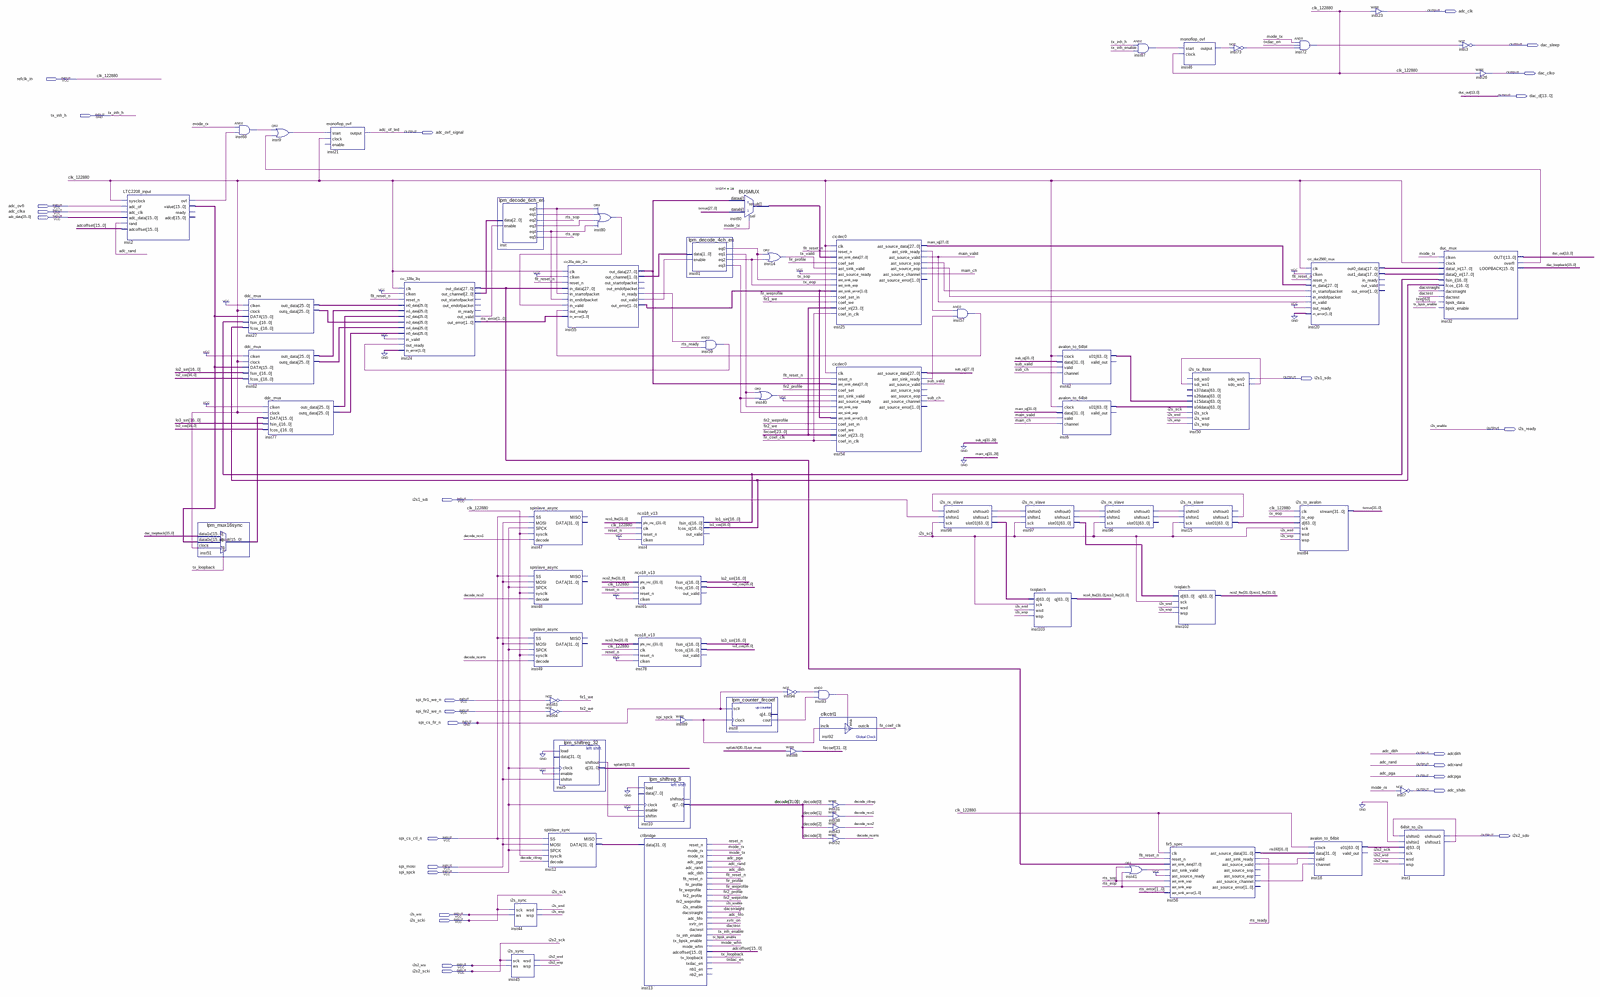
[diagram p0: schematic sheet, whole]
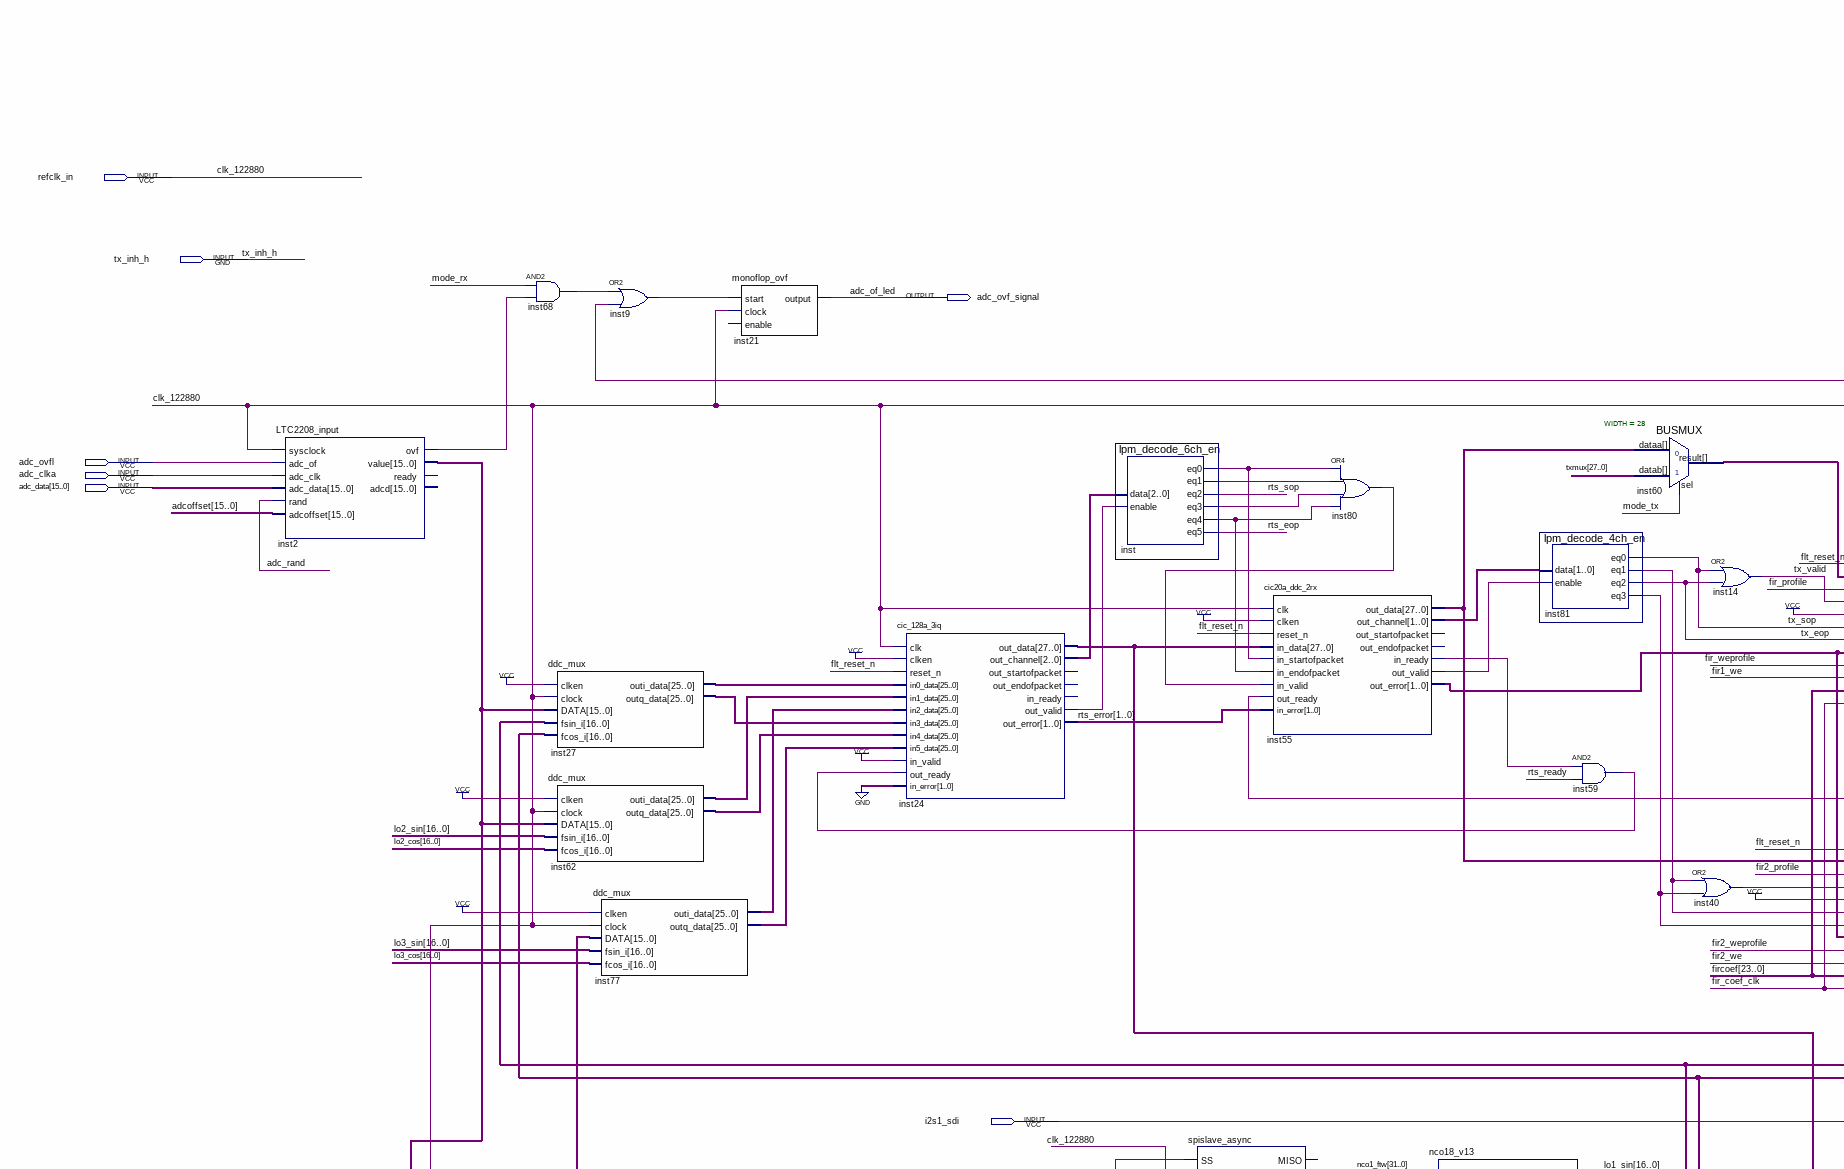
[diagram p1: schematic sheet, upper left part]
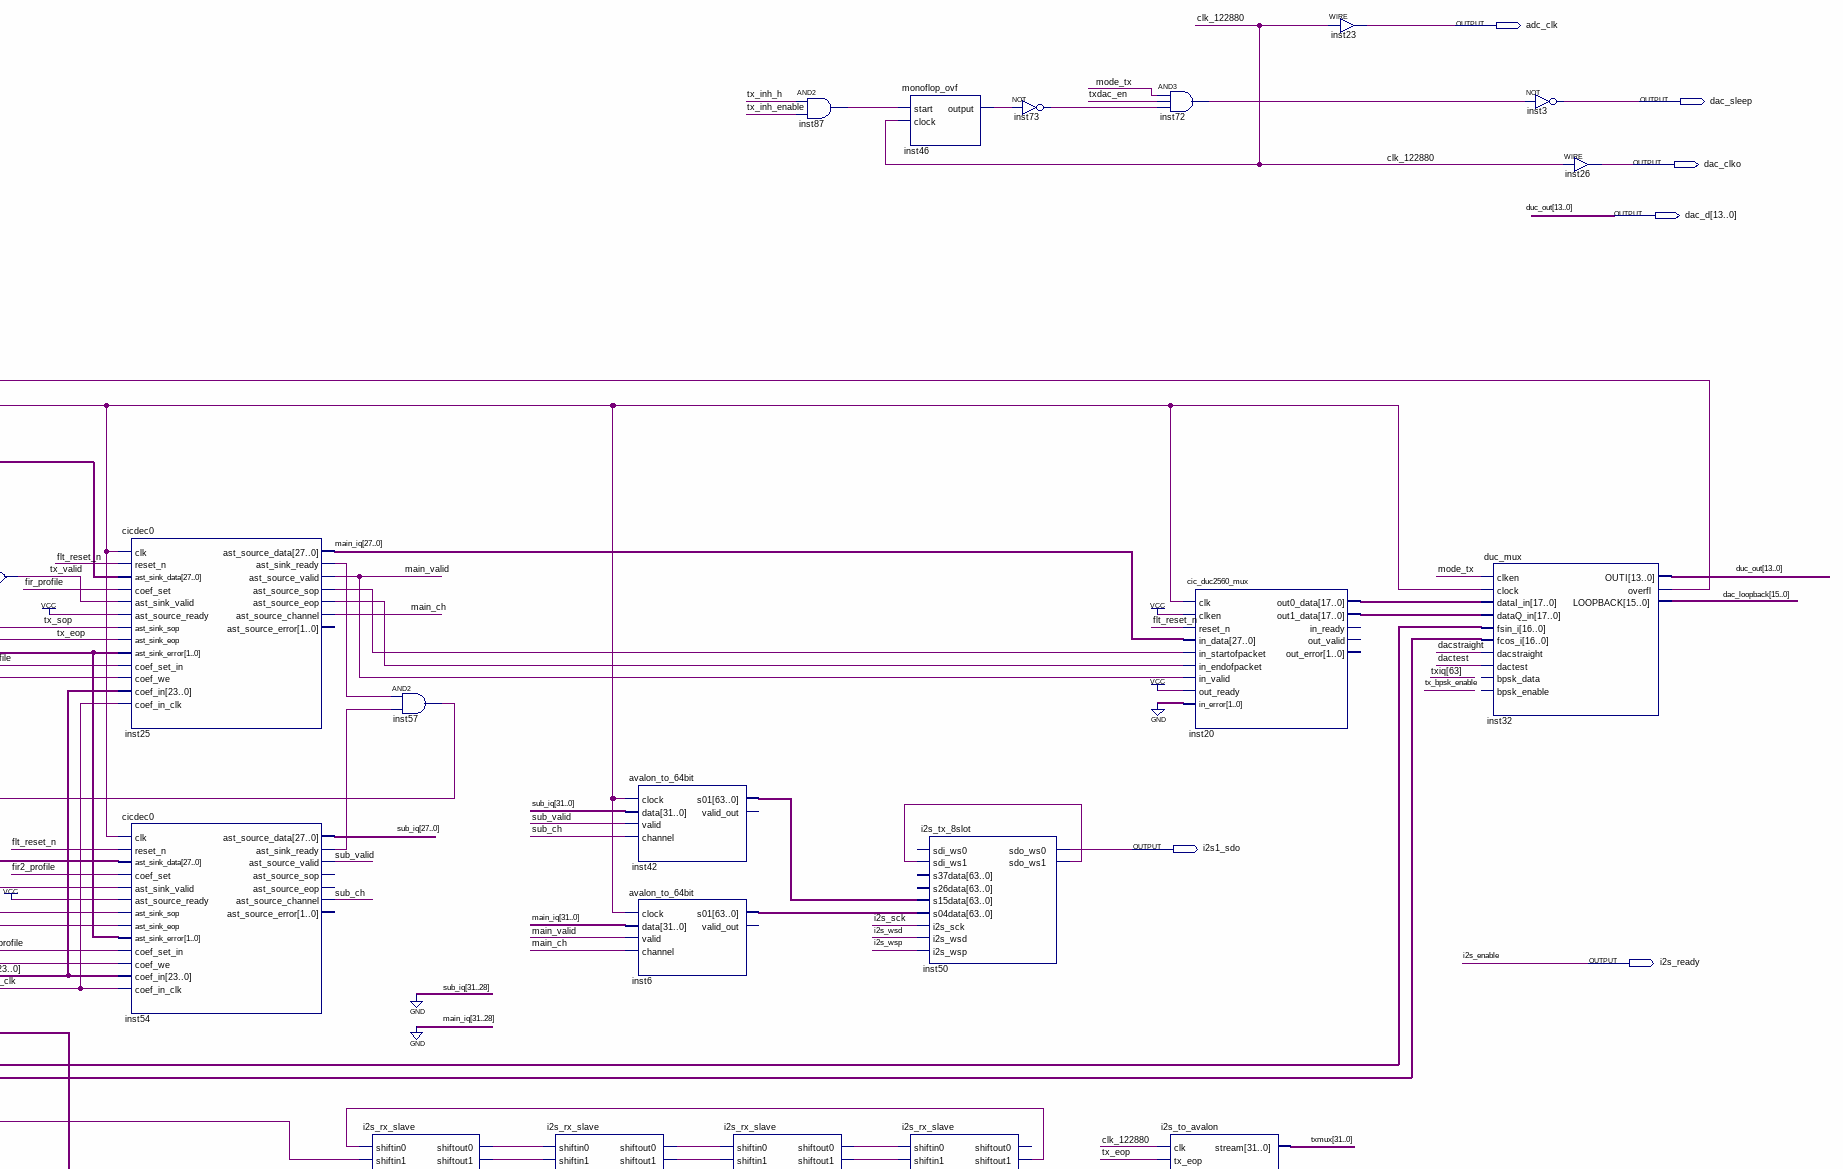
[diagram p2: schematic sheet, upper right part]
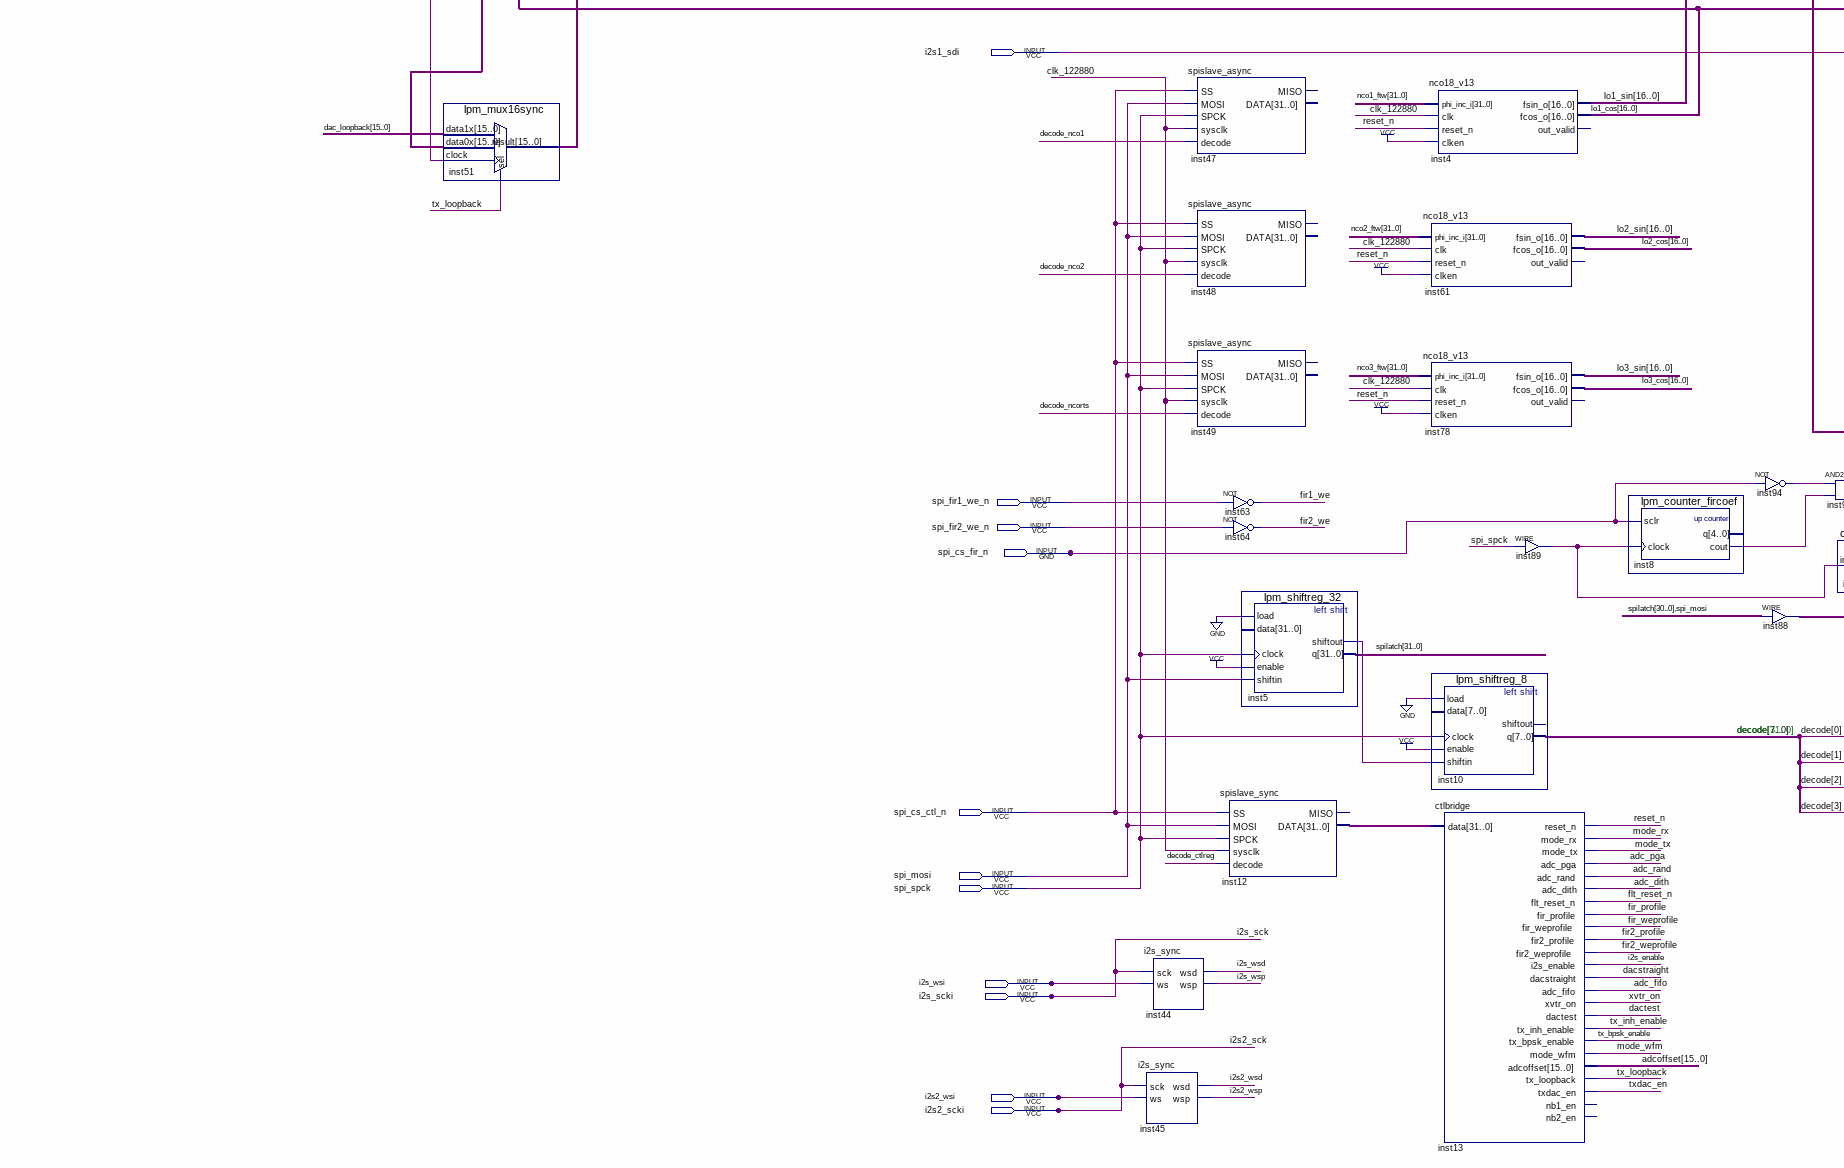
[diagram p3: schematic sheet, lower left part]
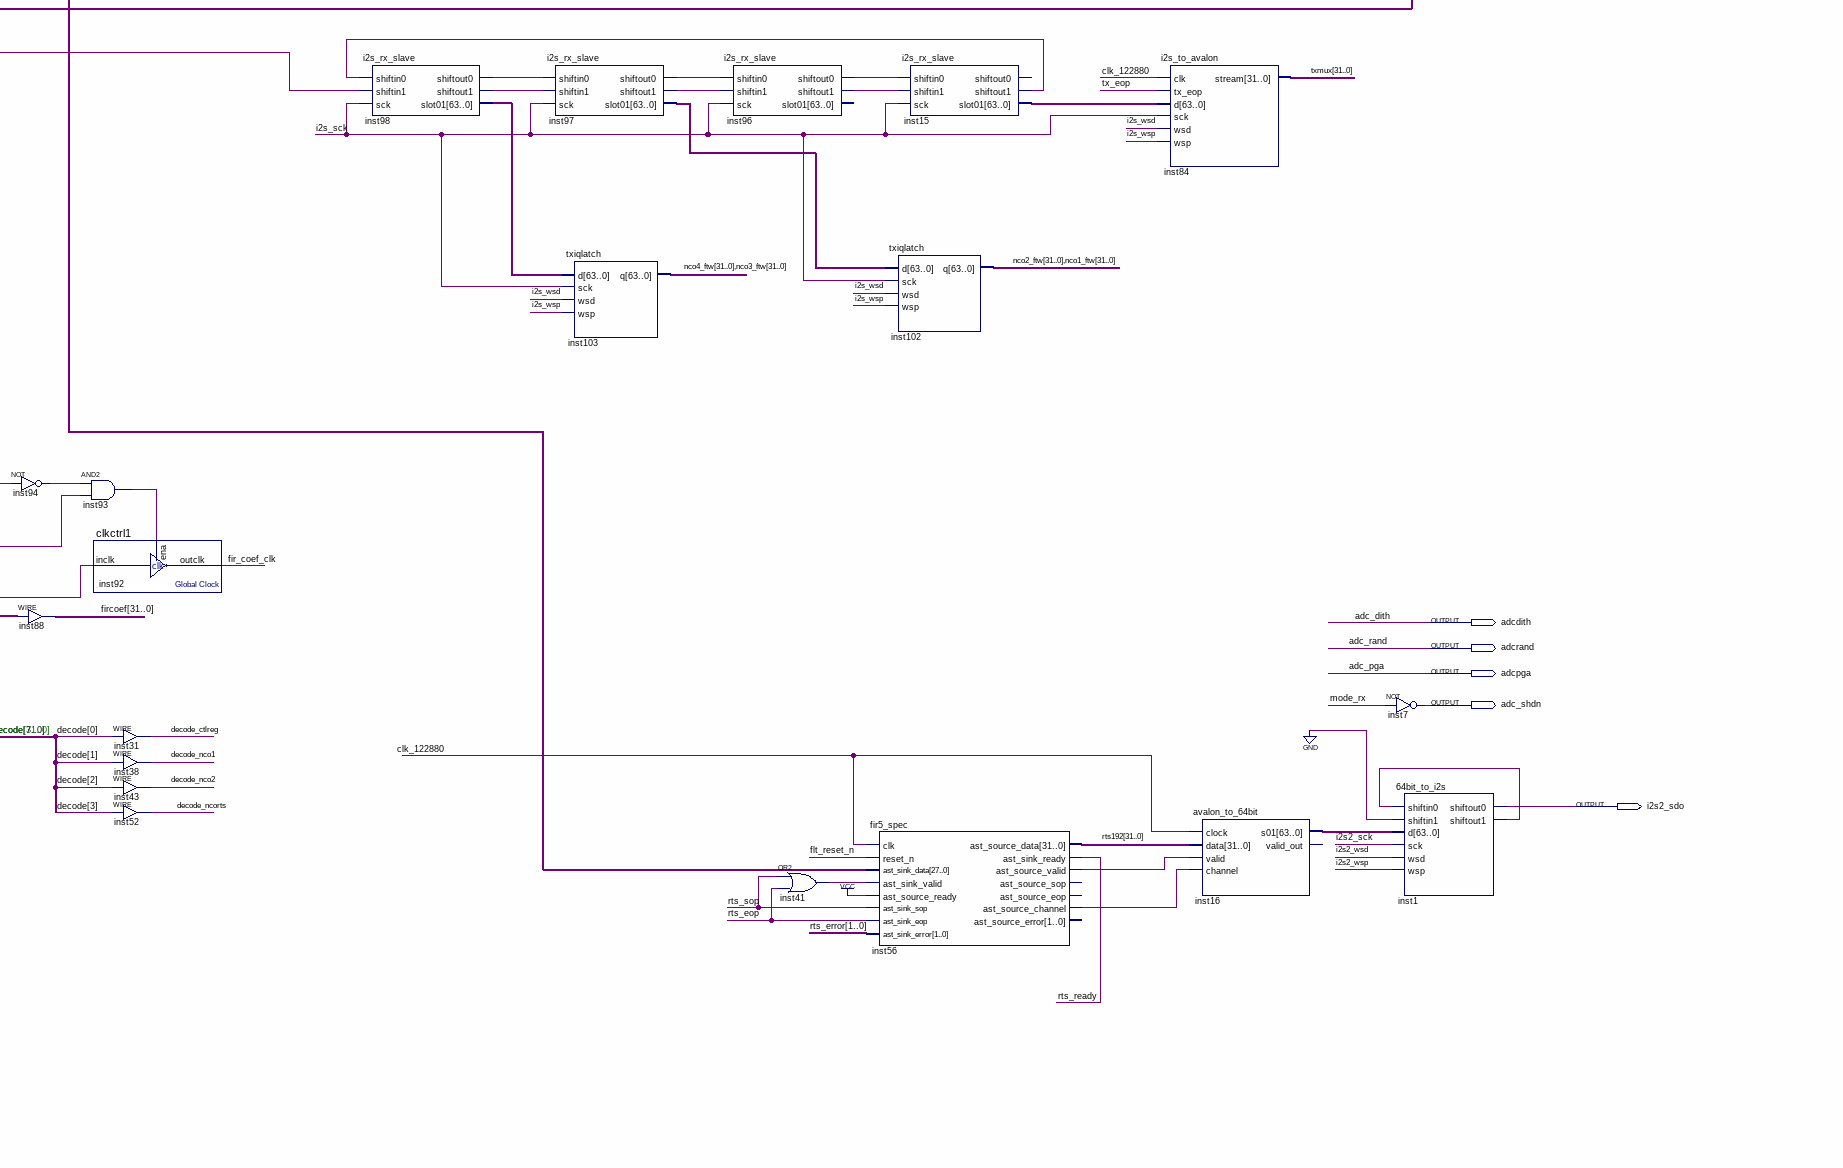
[diagram p4: schematic sheet, lower right part]
// Quartus schematic t1_2ch_rts192.bdf as structural Verilog: 68 symbols, 28 pins
module t1_2ch_rts192 (
  input  refclk_in,
  input  tx_inh_h,
  input  adc_ovfl,
  input  adc_clka,
  input  [15:0] adc_data,
  input  i2s1_sdi,
  input  spi_fir1_we_n,
  input  spi_fir2_we_n,
  input  spi_cs_fir_n,
  input  spi_cs_ctl_n,
  input  spi_mosi,
  input  spi_spck,
  input  i2s_wsi,
  input  i2s_scki,
  input  i2s2_wsi,
  input  i2s2_scki,
  output adc_clk,
  output dac_sleep,
  output dac_clko,
  output [13:0] dac_d,
  output adc_ovf_signal,
  output i2s1_sdo,
  output i2s_ready,
  output adcdith,
  output adcrand,
  output adcpga,
  output adc_shdn,
  output i2s2_sdo
);

  wire adc_fifo, dacstraight, dactest, decode_ctlreg, decode_nco1, decode_nco2, decode_ncorts, fir1_we,
       fir2_profile, fir2_we, fir2_weprofile, fir_coef_clk, fir_profile, fir_weprofile, flt_reset_n,
       i2s2_wsd, i2s2_wsp, i2s_wsd, i2s_wsp, inst1_shiftout1, inst2_ovf, inst5_shiftout, inst8_cout,
       inst9_out, inst15_shiftout1, inst24_out_valid, inst25_ast_sink_ready, inst25_ast_source_eop,
       inst25_ast_source_sop, inst32_overfl, inst40_out, inst41_out, inst46_output, inst50_sdo_ws1,
       inst54_ast_sink_ready, inst55_in_ready, inst55_out_valid, inst56_ast_source_channel,
       inst56_ast_source_valid, inst57_out, inst59_out, inst68_out, inst72_out, inst73_out, inst80_out,
       inst81_eq1, inst81_eq3, inst87_out, inst89_out, inst93_out, inst94_out, inst96_shiftout0,
       inst96_shiftout1, inst97_shiftout0, inst97_shiftout1, inst98_shiftout0, inst98_shiftout1, inst_eq0,
       inst_eq1, inst_eq3, inst_eq4, main_ch, main_valid, mode_rx, mode_tx, mode_wfm, reset_n, rts_eop,
       rts_ready, rts_sop, sub_ch, sub_valid, tx_bpsk_enable, tx_eop, tx_inh_enable, tx_loopback, tx_sop,
       tx_valid, txdac_en, xvtr_on;
  wire [1:0] inst55_out_channel, inst55_out_error, rts_error;
  wire [2:0] inst24_out_channel;
  wire [7:0] decode;
  wire [15:0] adcoffset, dac_loopback, inst2_value, inst51_result;
  wire [16:0] lo1_cos, lo1_sin, lo2_cos, lo2_sin, lo3_cos, lo3_sin;
  wire [17:0] inst20_out0_data, inst20_out1_data;
  wire [25:0] inst27_outi_data, inst27_outq_data, inst62_outi_data, inst62_outq_data, inst77_outi_data,
       inst77_outq_data;
  wire [27:0] inst24_out_data, inst55_out_data, inst60_result, main_iq, sub_iq;
  wire [31:0] fircoef, inst12_data, nco1_ftw, nco2_ftw, nco3_ftw, nco4_ftw, rts192, spilatch, txmux;
  wire [63:0] inst6_s01, inst15_slot01, inst16_s01, inst42_s01, inst97_slot01, inst98_slot01;

  LTC2208_input inst2 (
    .sysclock(refclk_in), .adc_of(adc_ovfl), .adc_clk(adc_clka), .adc_data(adc_data), .\rand (adcrand),
    .adcoffset(adcoffset), .ovf(inst2_ovf), .value(inst2_value));  // open: ready, adcd
  lpm_mux16sync inst51 (
    .data1x(dac_loopback), .data0x(inst2_value), .clock(refclk_in), .sel(tx_loopback), .result(inst51_result));
  and inst68 (inst68_out, mode_rx, inst2_ovf);
  ddc_mux inst27 (
    .clken(1'b1), .clock(refclk_in), .DATA(inst2_value), .fsin_i(lo1_sin), .fcos_i(lo1_cos),
    .outi_data(inst27_outi_data), .outq_data(inst27_outq_data));
  ddc_mux inst62 (
    .clken(1'b1), .clock(refclk_in), .DATA(inst2_value), .fsin_i(lo2_sin), .fcos_i(lo2_cos),
    .outi_data(inst62_outi_data), .outq_data(inst62_outq_data));
  or inst9 (inst9_out, inst68_out, inst32_overfl);
  ddc_mux inst77 (
    .clken(1'b1), .clock(refclk_in), .DATA(inst51_result), .fsin_i(lo3_sin), .fcos_i(lo3_cos),
    .outi_data(inst77_outi_data), .outq_data(inst77_outq_data));
  monoflop_ovf inst21 (.start(inst9_out), .clock(refclk_in), .\output (adc_ovf_signal));  // open: enable
  cic_128a_3iq inst24 (
    .clk(refclk_in), .clken(1'b1), .reset_n(flt_reset_n), .in0_data(inst27_outi_data),
    .in1_data(inst62_outi_data), .in2_data(inst77_outi_data), .in3_data(inst27_outq_data),
    .in4_data(inst62_outq_data), .in5_data(inst77_outq_data), .in_valid(1'b1), .out_ready(inst59_out),
    .in_error(2'b00), .out_data(inst24_out_data), .out_channel(inst24_out_channel),
    .out_valid(inst24_out_valid), .out_error(rts_error));  // open: out_startofpacket, out_endofpacket, in_ready
  lpm_decode_6ch_en inst (
    .data(inst24_out_channel), .enable(inst24_out_valid), .eq0(inst_eq0), .eq1(inst_eq1), .eq2(rts_sop),
    .eq3(inst_eq3), .eq4(inst_eq4), .eq5(rts_eop));
  i2s_sync inst44 (.sck(i2s_scki), .ws(i2s_wsi), .wsd(i2s_wsd), .wsp(i2s_wsp));
  i2s_sync inst45 (.sck(i2s2_scki), .ws(i2s2_wsi), .wsd(i2s2_wsd), .wsp(i2s2_wsp));
  spislave_async inst47 (
    .SS(spi_cs_ctl_n), .MOSI(spi_mosi), .SPCK(spi_spck), .sysclk(refclk_in), .decode(decode_nco1));  // open: MISO, DATA
  spislave_async inst48 (
    .SS(spi_cs_ctl_n), .MOSI(spi_mosi), .SPCK(spi_spck), .sysclk(refclk_in), .decode(decode_nco2));  // open: MISO, DATA
  spislave_async inst49 (
    .SS(spi_cs_ctl_n), .MOSI(spi_mosi), .SPCK(spi_spck), .sysclk(refclk_in), .decode(decode_ncorts));  // open: MISO, DATA
  not inst63 (fir1_we, spi_fir1_we_n);
  not inst64 (fir2_we, spi_fir2_we_n);
  spislave_sync inst12 (
    .SS(spi_cs_ctl_n), .MOSI(spi_mosi), .SPCK(spi_spck), .sysclk(refclk_in), .decode(decode_ctlreg),
    .DATA(inst12_data));  // open: MISO
  cic20a_ddc_2rx inst55 (
    .clk(refclk_in), .clken(1'b1), .reset_n(flt_reset_n), .in_data(inst24_out_data),
    .in_startofpacket(inst_eq0), .in_endofpacket(inst_eq4), .in_valid(inst80_out), .out_ready(inst57_out),
    .in_error(rts_error), .out_data(inst55_out_data), .out_channel(inst55_out_channel),
    .in_ready(inst55_in_ready), .out_valid(inst55_out_valid), .out_error(inst55_out_error));  // open: out_startofpacket, out_endofpacket
  lpm_shiftreg_32 inst5 (
    .load(1'b0), .clock(spi_spck), .enable(1'b1), .shiftin(spi_mosi), .shiftout(inst5_shiftout), .q(spilatch));  // open: data
  or inst80 (inst80_out, inst_eq0, inst_eq1, inst_eq3, inst_eq4);
  nco18_v13 inst4 (
    .phi_inc_i(nco1_ftw), .clk(refclk_in), .reset_n(reset_n), .clken(1'b1), .fsin_o(lo1_sin), .fcos_o(lo1_cos));  // open: out_valid
  nco18_v13 inst61 (
    .phi_inc_i(nco2_ftw), .clk(refclk_in), .reset_n(reset_n), .clken(1'b1), .fsin_o(lo2_sin), .fcos_o(lo2_cos));  // open: out_valid
  nco18_v13 inst78 (
    .phi_inc_i(nco3_ftw), .clk(refclk_in), .reset_n(reset_n), .clken(1'b1), .fsin_o(lo3_sin), .fcos_o(lo3_cos));  // open: out_valid
  lpm_shiftreg_8 inst10 (
    .load(1'b0), .clock(spi_spck), .enable(1'b1), .shiftin(inst5_shiftout), .q(decode));  // open: data, shiftout
  ctlbridge inst13 (
    .data(inst12_data), .reset_n(reset_n), .mode_rx(mode_rx), .mode_tx(mode_tx), .adc_pga(adcpga),
    .adc_rand(adcrand), .adc_dith(adcdith), .flt_reset_n(flt_reset_n), .fir_profile(fir_profile),
    .fir_weprofile(fir_weprofile), .fir2_profile(fir2_profile), .fir2_weprofile(fir2_weprofile),
    .i2s_enable(i2s_ready), .dacstraight(dacstraight), .adc_fifo(adc_fifo), .xvtr_on(xvtr_on),
    .dactest(dactest), .tx_inh_enable(tx_inh_enable), .tx_bpsk_enable(tx_bpsk_enable), .mode_wfm(mode_wfm),
    .adcoffset(adcoffset), .tx_loopback(tx_loopback), .txdac_en(txdac_en));  // open: nb1_en, nb2_en
  assign inst89_out = spi_spck;  // WIRE inst89
  lpm_decode_4ch_en inst81 (
    .data(inst55_out_channel), .enable(inst55_out_valid), .eq0(tx_sop), .eq1(inst81_eq1), .eq2(tx_eop),
    .eq3(inst81_eq3));
  and inst59 (inst59_out, inst55_in_ready, rts_ready);
  BUSMUX #(.WIDTH(28)) inst60 (.datab(txmux[27:0]), .sel(mode_tx), .dataa(inst55_out_data), .result(inst60_result));
  lpm_counter_fircoef inst8 (.sclr(spi_cs_fir_n), .clock(inst89_out), .cout(inst8_cout));  // open: q
  or inst14 (tx_valid, tx_sop, tx_eop);
  or inst40 (inst40_out, inst81_eq1, inst81_eq3);
  not inst94 (inst94_out, spi_cs_fir_n);
  assign fircoef = {spilatch[30:0], spi_mosi};  // WIRE inst88
  and inst93 (inst93_out, inst94_out, inst8_cout);
  clkctrl1 inst92 (.inclk(inst89_out), .ena(inst93_out), .outclk(fir_coef_clk));
  cicdec0 inst25 (
    .clk(refclk_in), .reset_n(flt_reset_n), .ast_sink_data(inst60_result), .coef_set(fir_profile),
    .ast_sink_valid(tx_valid), .ast_source_ready(1'b1), .ast_sink_sop(tx_sop), .ast_sink_eop(tx_eop),
    .ast_sink_error(inst55_out_error), .coef_set_in(fir_weprofile), .coef_we(fir1_we),
    .coef_in(fircoef[23:0]), .coef_in_clk(fir_coef_clk), .ast_source_data(main_iq),
    .ast_sink_ready(inst25_ast_sink_ready), .ast_source_valid(main_valid),
    .ast_source_sop(inst25_ast_source_sop), .ast_source_eop(inst25_ast_source_eop),
    .ast_source_channel(main_ch));  // open: ast_source_error
  cicdec0 inst54 (
    .clk(refclk_in), .reset_n(flt_reset_n), .ast_sink_data(inst55_out_data), .coef_set(fir2_profile),
    .ast_sink_valid(inst40_out), .ast_source_ready(1'b1), .ast_sink_sop(inst81_eq1),
    .ast_sink_eop(inst81_eq3), .ast_sink_error(inst55_out_error), .coef_set_in(fir2_weprofile),
    .coef_we(fir2_we), .coef_in(fircoef[23:0]), .coef_in_clk(fir_coef_clk), .ast_source_data(sub_iq),
    .ast_sink_ready(inst54_ast_sink_ready), .ast_source_valid(sub_valid), .ast_source_channel(sub_ch));  // open: ast_source_sop, ast_source_eop, ast_source_error
  assign decode_ctlreg = decode[0];  // WIRE inst31
  assign decode_nco1 = decode[1];  // WIRE inst38
  assign decode_nco2 = decode[2];  // WIRE inst43
  assign decode_ncorts = decode[3];  // WIRE inst52
  and inst57 (inst57_out, inst25_ast_sink_ready, inst54_ast_sink_ready);
  i2s_rx_slave inst98 (
    .shiftin0(inst15_shiftout1), .shiftin1(i2s1_sdi), .sck(i2s_scki), .shiftout0(inst98_shiftout0),
    .shiftout1(inst98_shiftout1), .slot01(inst98_slot01));
  i2s_rx_slave inst97 (
    .shiftin0(inst98_shiftout0), .shiftin1(inst98_shiftout1), .sck(i2s_scki), .shiftout0(inst97_shiftout0),
    .shiftout1(inst97_shiftout1), .slot01(inst97_slot01));
  txiqlatch inst103 (.d(inst98_slot01), .sck(i2s_scki), .wsd(i2s_wsd), .wsp(i2s_wsp), .q({nco4_ftw, nco3_ftw}));
  avalon_to_64bit inst42 (
    .clock(refclk_in), .data({4'b0000, sub_iq}), .valid(sub_valid), .channel(sub_ch), .s01(inst42_s01));  // open: valid_out
  avalon_to_64bit inst6 (
    .clock(refclk_in), .data({4'b0000, main_iq}), .valid(main_valid), .channel(main_ch), .s01(inst6_s01));  // open: valid_out
  i2s_rx_slave inst96 (
    .shiftin0(inst97_shiftout0), .shiftin1(inst97_shiftout1), .sck(i2s_scki), .shiftout0(inst96_shiftout0),
    .shiftout1(inst96_shiftout1));  // open: slot01
  and inst87 (inst87_out, tx_inh_h, tx_inh_enable);
  or inst41 (inst41_out, rts_sop, rts_eop);
  monoflop_ovf inst46 (.start(inst87_out), .clock(refclk_in), .\output (inst46_output));
  i2s_rx_slave inst15 (
    .shiftin0(inst96_shiftout0), .shiftin1(inst96_shiftout1), .sck(i2s_scki), .shiftout1(inst15_shiftout1),
    .slot01(inst15_slot01));  // open: shiftout0
  txiqlatch inst102 (.d(inst97_slot01), .sck(i2s_scki), .wsd(i2s_wsd), .wsp(i2s_wsp), .q({nco2_ftw, nco1_ftw}));
  fir5_spec inst56 (
    .clk(refclk_in), .reset_n(flt_reset_n), .ast_sink_data(inst24_out_data), .ast_sink_valid(inst41_out),
    .ast_source_ready(1'b1), .ast_sink_sop(rts_sop), .ast_sink_eop(rts_eop), .ast_sink_error(rts_error),
    .ast_source_data(rts192), .ast_sink_ready(rts_ready), .ast_source_valid(inst56_ast_source_valid),
    .ast_source_channel(inst56_ast_source_channel));  // open: ast_source_sop, ast_source_eop, ast_source_error
  i2s_tx_8slot inst50 (
    .sdi_ws1(inst50_sdo_ws1), .s15data(inst42_s01), .s04data(inst6_s01), .i2s_sck(i2s_scki),
    .i2s_wsd(i2s_wsd), .i2s_wsp(i2s_wsp), .sdo_ws0(i2s1_sdo), .sdo_ws1(inst50_sdo_ws1));  // open: sdi_ws0, s37data, s26data
  not inst73 (inst73_out, inst46_output);
  and inst72 (inst72_out, mode_tx, txdac_en, inst73_out);
  i2s_to_avalon inst84 (
    .clk(refclk_in), .tx_eop(tx_eop), .d(inst15_slot01), .sck(i2s_scki), .wsd(i2s_wsd), .wsp(i2s_wsp),
    .stream(txmux));
  cic_duc2560_mux inst20 (
    .clk(refclk_in), .clken(1'b1), .reset_n(flt_reset_n), .in_data(main_iq),
    .in_startofpacket(inst25_ast_source_sop), .in_endofpacket(inst25_ast_source_eop), .in_valid(main_valid),
    .out_ready(1'b1), .in_error(2'b00), .out0_data(inst20_out0_data), .out1_data(inst20_out1_data));  // open: in_ready, out_valid, out_error
  avalon_to_64bit inst16 (
    .clock(refclk_in), .data(rts192), .valid(inst56_ast_source_valid), .channel(inst56_ast_source_channel),
    .s01(inst16_s01));  // open: valid_out
  assign adc_clk = refclk_in;  // WIRE inst23
  not inst7 (adc_shdn, mode_rx);
  \64bit_to_i2s  inst1 (
    .shiftin0(inst1_shiftout1), .shiftin1(1'b0), .d(inst16_s01), .sck(i2s2_scki), .wsd(i2s2_wsd),
    .wsp(i2s2_wsp), .shiftout0(i2s2_sdo), .shiftout1(inst1_shiftout1));
  duc_mux inst32 (
    .clken(mode_tx), .clock(refclk_in), .dataI_in(inst20_out0_data), .dataQ_in(inst20_out1_data),
    .fsin_i(lo1_sin), .fcos_i(lo1_cos), .dacstraight(dacstraight), .dactest(dactest), .OUTI(dac_d),
    .overfl(inst32_overfl), .LOOPBACK(dac_loopback));  // open: bpsk_data, bpsk_enable
  not inst3 (dac_sleep, inst72_out);
  assign dac_clko = refclk_in;  // WIRE inst26

  // Other names for the same wires on the sheet: adc_dith = adcdith; adc_of_led = adc_ovf_signal; adc_pga = adcpga;
  //   adc_rand = adcrand; clk_122880 = refclk_in; duc_out[13:0] = dac_d; i2s2_sck = i2s2_scki; i2s_enable = i2s_ready;
  //   i2s_sck = i2s_scki

  // Notes on the sheet:
  //   decode[31..0]
endmodule
